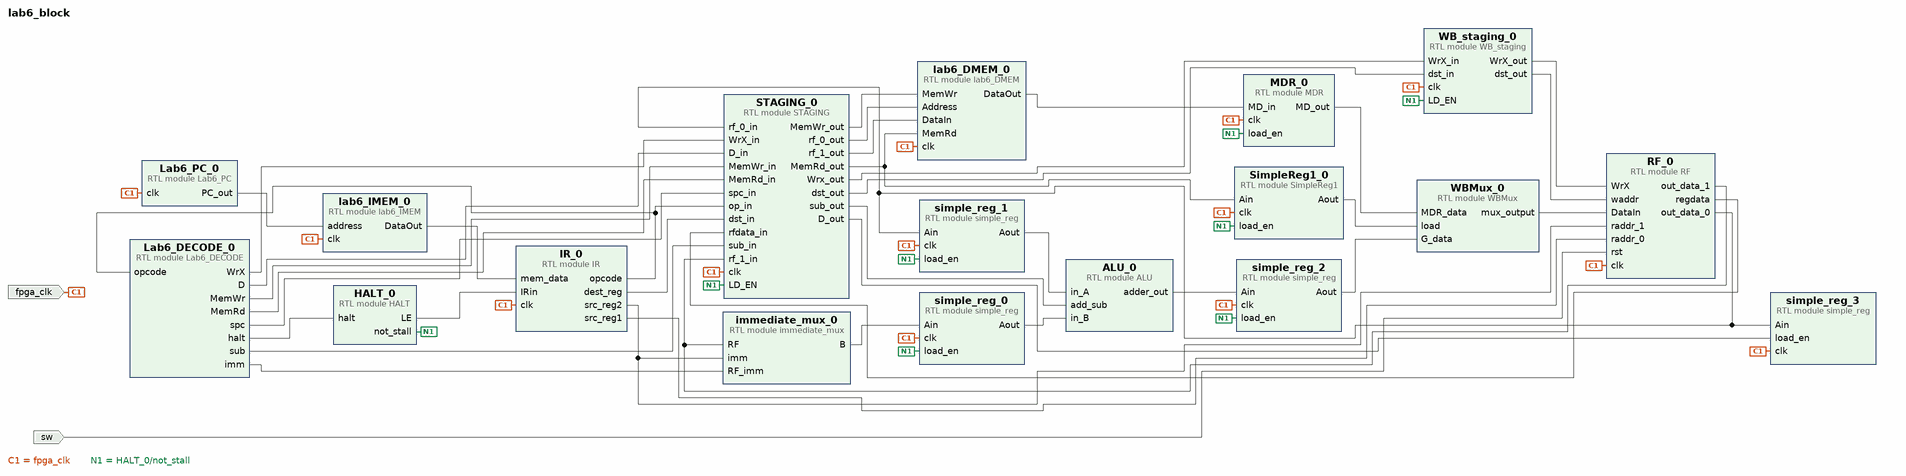
[diagram p0: block diagram of the top level]
# Vivado block design lab6_block, xc7a100tcsg324-2, Vivado 2019.1
create_bd_design lab6_block

create_bd_port -dir I fpga_clk
create_bd_port -dir I sw

create_bd_cell -type module -reference ALU ALU_0
create_bd_cell -type module -reference simple_reg simple_reg_0
create_bd_cell -type module -reference lab6_IMEM lab6_IMEM_0
create_bd_cell -type module -reference lab6_DMEM lab6_DMEM_0
create_bd_cell -type module -reference immediate_mux immediate_mux_0
create_bd_cell -type module -reference RF RF_0
create_bd_cell -type module -reference MDR MDR_0
create_bd_cell -type module -reference Lab6_PC Lab6_PC_0
create_bd_cell -type module -reference IR IR_0
create_bd_cell -type module -reference simple_reg simple_reg_1
create_bd_cell -type module -reference simple_reg simple_reg_2
create_bd_cell -type module -reference Lab6_DECODE Lab6_DECODE_0
create_bd_cell -type module -reference simple_reg simple_reg_3
create_bd_cell -type module -reference STAGING STAGING_0
create_bd_cell -type module -reference WB_staging WB_staging_0
create_bd_cell -type module -reference WBMux WBMux_0
create_bd_cell -type module -reference SimpleReg1 SimpleReg1_0
create_bd_cell -type module -reference HALT HALT_0

# ---- connections ----

connect_bd_net [get_bd_pins Lab6_PC_0/PC_out] [get_bd_pins lab6_IMEM_0/address]
connect_bd_net [get_bd_pins lab6_IMEM_0/DataOut] [get_bd_pins IR_0/mem_data]
connect_bd_net [get_bd_pins immediate_mux_0/B] [get_bd_pins simple_reg_0/Ain]
connect_bd_net [get_bd_pins simple_reg_0/Aout] [get_bd_pins ALU_0/in_B]
connect_bd_net [get_bd_pins ALU_0/adder_out] [get_bd_pins simple_reg_2/Ain]
connect_bd_net [get_bd_pins lab6_DMEM_0/DataOut] [get_bd_pins MDR_0/MD_in]
connect_bd_net [get_bd_pins Lab6_DECODE_0/halt] [get_bd_pins HALT_0/halt]
connect_bd_net [get_bd_pins HALT_0/LE] [get_bd_pins IR_0/IRin]
connect_bd_net [get_bd_pins simple_reg_1/Aout] [get_bd_pins ALU_0/in_A]
connect_bd_net [get_bd_pins IR_0/src_reg2] [get_bd_pins immediate_mux_0/imm] [get_bd_pins RF_0/raddr_1]
connect_bd_net [get_bd_pins RF_0/out_data_1] [get_bd_pins immediate_mux_0/RF] [get_bd_pins STAGING_0/rf_1_in]
connect_bd_net [get_bd_pins RF_0/out_data_0] [get_bd_pins simple_reg_1/Ain] [get_bd_pins STAGING_0/rf_0_in] [get_bd_pins simple_reg_3/Ain]
connect_bd_net [get_bd_pins Lab6_DECODE_0/imm] [get_bd_pins immediate_mux_0/RF_imm]
connect_bd_net [get_bd_pins Lab6_DECODE_0/WrX] [get_bd_pins STAGING_0/WrX_in]
connect_bd_net [get_bd_pins Lab6_DECODE_0/D] [get_bd_pins STAGING_0/D_in]
connect_bd_net [get_bd_pins Lab6_DECODE_0/MemWr] [get_bd_pins STAGING_0/MemWr_in]
connect_bd_net [get_bd_pins Lab6_DECODE_0/MemRd] [get_bd_pins STAGING_0/MemRd_in]
connect_bd_net [get_bd_pins IR_0/opcode] [get_bd_pins Lab6_DECODE_0/opcode] [get_bd_pins STAGING_0/op_in]
connect_bd_net [get_bd_pins Lab6_DECODE_0/spc] [get_bd_pins STAGING_0/spc_in]
connect_bd_net [get_bd_pins Lab6_DECODE_0/sub] [get_bd_pins STAGING_0/sub_in]
connect_bd_net [get_bd_pins STAGING_0/sub_out] [get_bd_pins ALU_0/add_sub]
connect_bd_net [get_bd_pins IR_0/dest_reg] [get_bd_pins STAGING_0/dst_in]
connect_bd_net [get_bd_pins RF_0/regdata] [get_bd_pins STAGING_0/rfdata_in]
connect_bd_net [get_bd_pins STAGING_0/Wrx_out] [get_bd_pins WB_staging_0/WrX_in]
connect_bd_net [get_bd_pins STAGING_0/MemWr_out] [get_bd_pins lab6_DMEM_0/MemWr]
connect_bd_net [get_bd_pins STAGING_0/dst_out] [get_bd_pins WB_staging_0/dst_in]
connect_bd_net [get_bd_pins STAGING_0/rf_0_out] [get_bd_pins lab6_DMEM_0/Address]
connect_bd_net [get_bd_pins STAGING_0/rf_1_out] [get_bd_pins lab6_DMEM_0/DataIn]
connect_bd_net [get_bd_pins STAGING_0/D_out] [get_bd_pins simple_reg_3/load_en]
connect_bd_net [get_bd_pins WB_staging_0/WrX_out] [get_bd_pins RF_0/WrX]
connect_bd_net [get_bd_pins WB_staging_0/dst_out] [get_bd_pins RF_0/waddr]
connect_bd_net [get_bd_pins simple_reg_2/Aout] [get_bd_pins WBMux_0/G_data]
connect_bd_net [get_bd_pins WBMux_0/mux_output] [get_bd_pins RF_0/DataIn]
connect_bd_net [get_bd_pins MDR_0/MD_out] [get_bd_pins WBMux_0/MDR_data]
connect_bd_net [get_bd_pins STAGING_0/MemRd_out] [get_bd_pins lab6_DMEM_0/MemRd] [get_bd_pins SimpleReg1_0/Ain]
connect_bd_net [get_bd_pins SimpleReg1_0/Aout] [get_bd_pins WBMux_0/load]
connect_bd_net [get_bd_ports fpga_clk] \
  [get_bd_pins Lab6_PC_0/clk] [get_bd_pins lab6_IMEM_0/clk] [get_bd_pins IR_0/clk] [get_bd_pins RF_0/clk] \
  [get_bd_pins STAGING_0/clk] [get_bd_pins simple_reg_3/clk] [get_bd_pins simple_reg_0/clk] [get_bd_pins simple_reg_1/clk] \
  [get_bd_pins simple_reg_2/clk] [get_bd_pins WB_staging_0/clk] [get_bd_pins SimpleReg1_0/clk] [get_bd_pins lab6_DMEM_0/clk] \
  [get_bd_pins MDR_0/clk]
connect_bd_net [get_bd_pins IR_0/src_reg1] [get_bd_pins RF_0/raddr_0]
connect_bd_net [get_bd_ports sw] [get_bd_pins RF_0/rst]
connect_bd_net [get_bd_pins HALT_0/not_stall] \
  [get_bd_pins STAGING_0/LD_EN] [get_bd_pins simple_reg_0/load_en] [get_bd_pins simple_reg_1/load_en] \
  [get_bd_pins WB_staging_0/LD_EN] [get_bd_pins simple_reg_2/load_en] [get_bd_pins SimpleReg1_0/load_en] \
  [get_bd_pins MDR_0/load_en]

validate_bd_design
save_bd_design
